# EAGLE design amp_tda8425_v_1_0 (EAGLE 9.3.1)
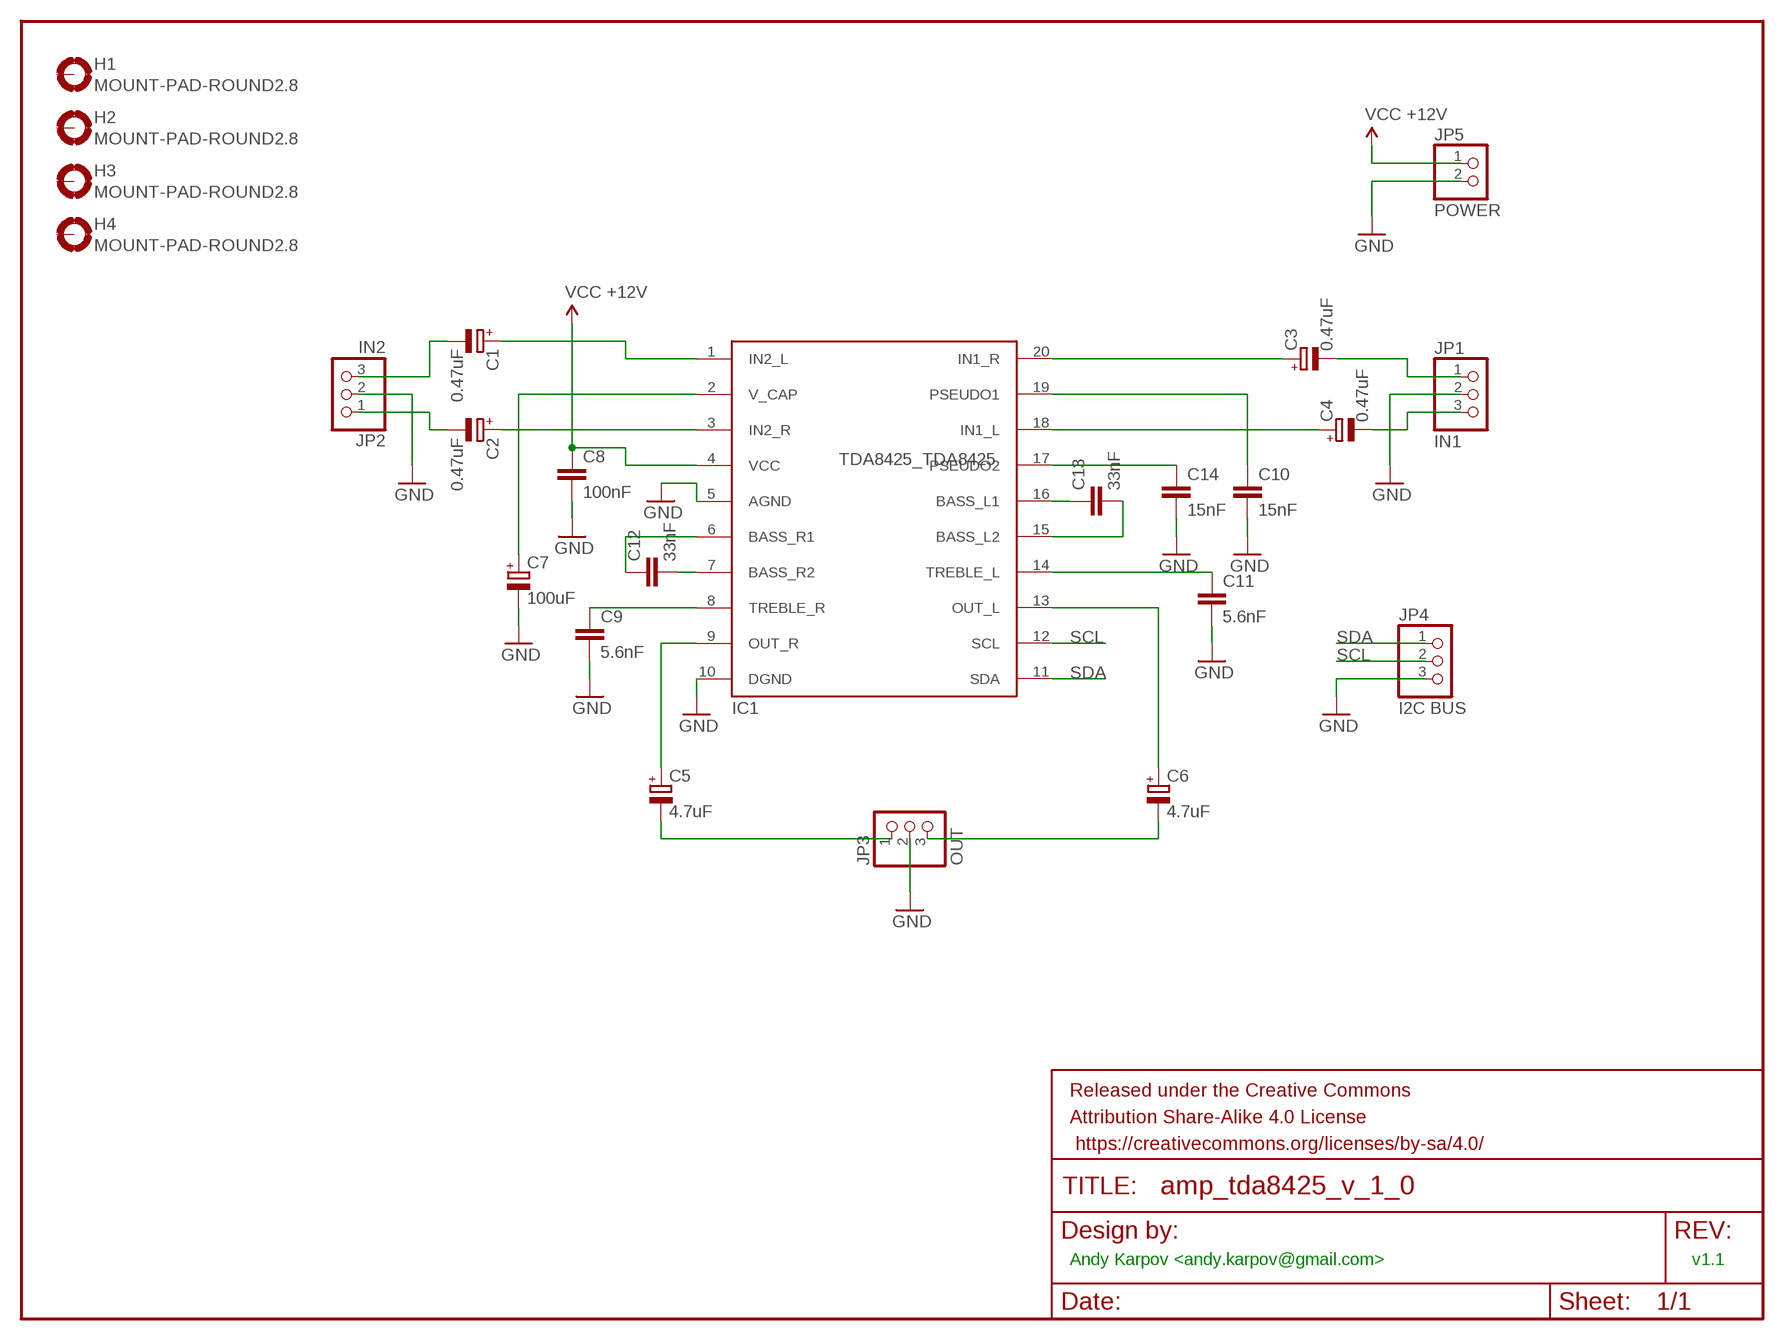
[diagram p0: schematic, sheet 1]

## Parts
C1  0.47uF  CPOL-EUE2.5-6  [E2,5-6]
C2  0.47uF  CPOL-EUE2.5-6  [E2,5-6]
C3  0.47uF  CPOL-EUE2.5-6  [E2,5-6]
C4  0.47uF  CPOL-EUE2.5-6  [E2,5-6]
C5  4.7uF  CPOL-EUE2.5-6  [E2,5-6]
C6  4.7uF  CPOL-EUE2.5-6  [E2,5-6]
C7  100uF  CPOL-EUE2.5-6  [E2,5-6]
C8  100nF  C-EU025-025X050  [C025-025X050]
C9  5.6nF  C-EU025-025X050  [C025-025X050]
C10  15nF  C-EU025-025X050  [C025-025X050]
C11  5.6nF  C-EU025-025X050  [C025-025X050]
C12  33nF  C-EU025-025X050  [C025-025X050]
C13  33nF  C-EU025-025X050  [C025-025X050]
C14  15nF  C-EU025-025X050  [C025-025X050]
FRAME1  FRAME-LETTER  [CREATIVE_COMMONS]
H1  MOUNT-PAD-ROUND2.8  [2,8-PAD]
H2  MOUNT-PAD-ROUND2.8  [2,8-PAD]
H3  MOUNT-PAD-ROUND2.8  [2,8-PAD]
H4  MOUNT-PAD-ROUND2.8  [2,8-PAD]
IC1  TDA8425_TDA8425  [TDA8425_DIL20]
JP1  IN1  PINHD-1X3  [1X03]
JP2  IN2  PINHD-1X3  [1X03]
JP3  OUT  PINHD-1X3  [1X03]
JP4  I2C BUS  PINHD-1X3  [1X03]
JP5  POWER  PINHD-1X2  [1X02]

## Nets
GND: C7.- C8.2 C9.2 C10.2 C11.2 C14.2 IC1.5(AGND) IC1.10(DGND) JP1.2 JP2.2 JP3.2 JP4.3 JP5.2
N$1: C1.+ IC1.1(IN2_L)
N$2: C1.- JP2.3
N$3: C2.+ IC1.3(IN2_R)
N$4: C2.- JP2.1
N$5: C3.+ IC1.20(IN1_R)
N$6: C4.+ IC1.18(IN1_L)
N$7: C3.- JP1.1
N$8: C4.- JP1.3
N$9: C7.+ IC1.2(V_CAP)
N$10: C12.1 IC1.6(BASS_R1)
N$11: C12.2 IC1.7(BASS_R2)
N$12: C9.1 IC1.8(TREBLE_R)
N$13: C5.+ IC1.9(OUT_R)
N$14: C5.- JP3.1
N$15: C6.+ IC1.13(OUT_L)
N$16: C6.- JP3.3
N$17: C13.1 IC1.16(BASS_L1)
N$18: C13.2 IC1.15(BASS_L2)
N$19: C14.1 IC1.17(PSEUDO2)
N$20: C11.1 IC1.14(TREBLE_L)
N$21: C10.1 IC1.19(PSEUDO1)
SCL: IC1.12(SCL) JP4.2
SDA: IC1.11(SDA) JP4.1
VCC: C8.1 IC1.4(VCC) JP5.1 ; supply symbol labelled VCC +12V
Unconnected: H1.B2,8(MOUNT) H2.B2,8(MOUNT) H3.B2,8(MOUNT) H4.B2,8(MOUNT)

## Notes on the sheet
- Andy Karpov <andy.karpov@gmail.com> | v1.1

## Library data of the parts
C1-C7 = rcl:CPOL-EU: POLARIZED CAPACITOR, European symbol; SPICEPREFIX: C
C8-C14 = rcl_mod:C-EU: CAPACITOR, European symbol
FRAME1 = SparkFun-Aesthetics:FRAME-LETTER: Schematic Frame - Letter Standard 8.5x11 US Letter frame
H1-H4 = holes:MOUNT-PAD-ROUND: MOUNTING PAD, round
IC1 = amp_tda8425_v_1_0:TDA8425_TDA8425: I2C bus controlled Audio HiFi Sound Processor
JP1-JP4 = pinhead:PINHD-1X3: PIN HEADER
JP5 = pinhead:PINHD-1X2: PIN HEADER

## Board
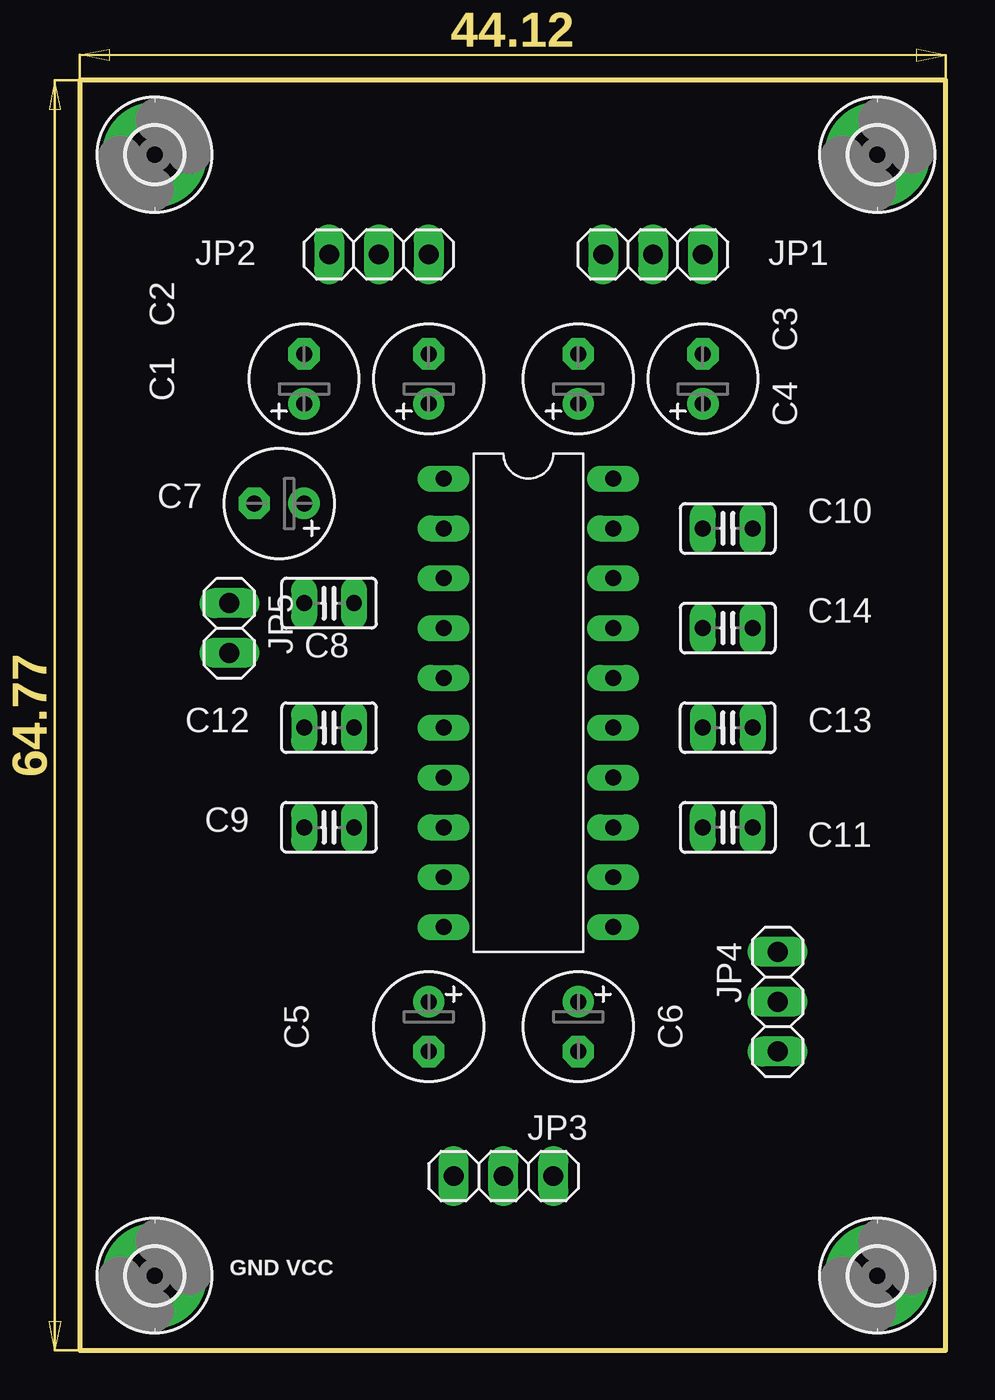
[diagram p1: board, top side]
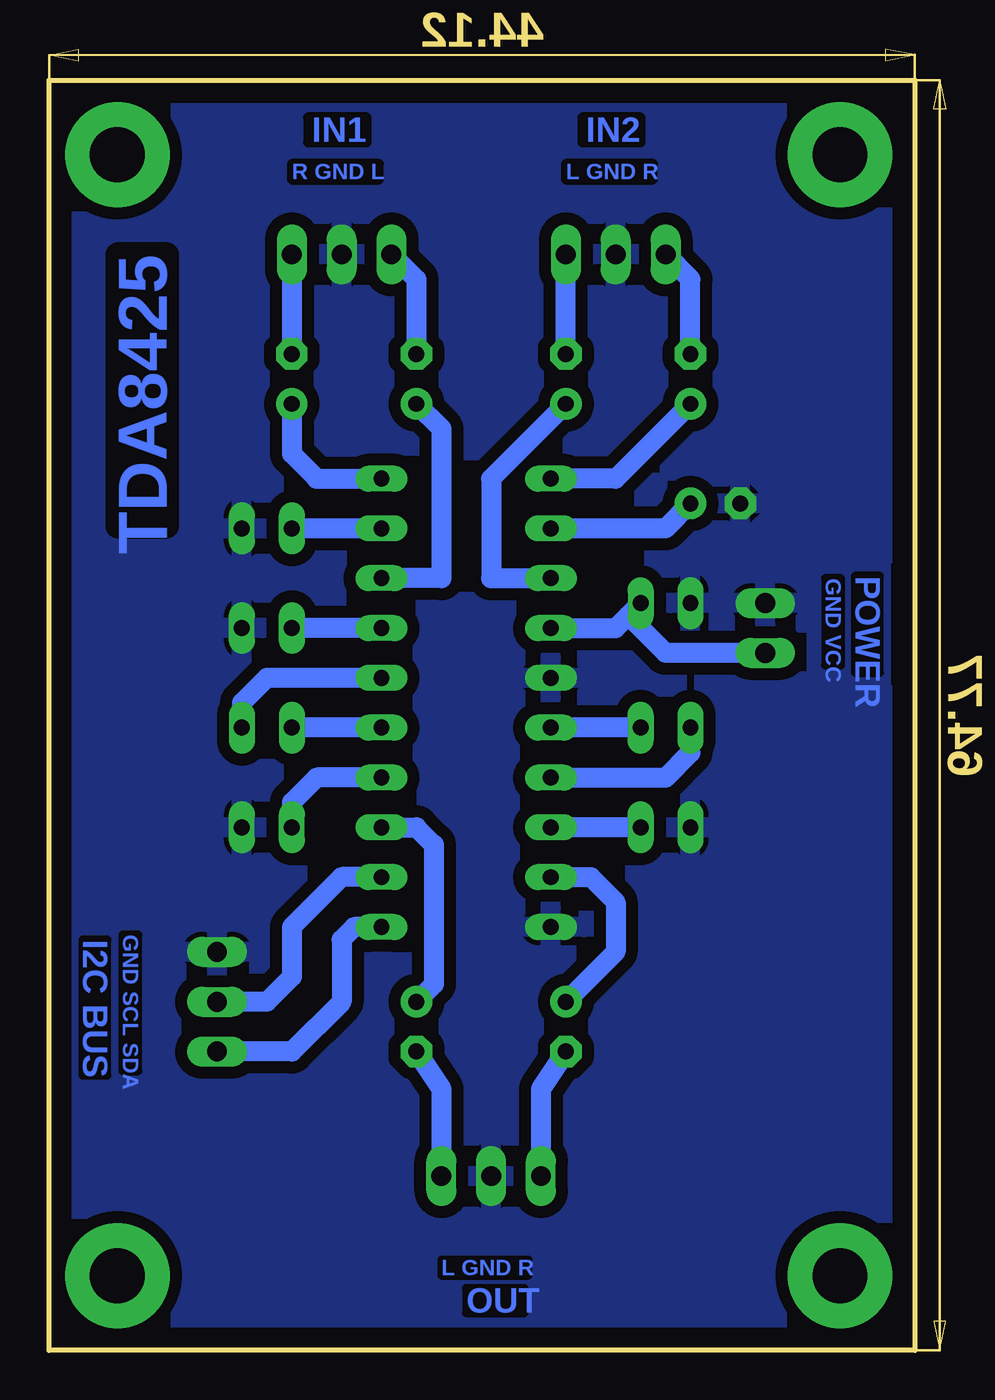
[diagram p2: board, bottom side, seen from below]

Size 44.12 x 64.76 mm. Coordinates in mm from the lower left corner, seen from the top.
Outline: 0,0 44.12,0 44.12,64.76 0,64.76 0,0
Copper layers (1*16): Top 0.035mm / dielectric 1.5mm / Bottom 0.035mm
Design rules "default": minimum track width 10mil, minimum drill 24mil, track to track 8mil, track to pad 8mil, pad to pad 8mil, via to via 8mil, smd to smd 8mil, copper to edge 40mil, drill to drill 8mil, minimum pad ring 10mil, minimum via ring 8mil, stop-mask expansion 4mil, vias tented up to drill 0mil, thermal gap 10mil

### Footprints (pad centres in the part's own frame; a part is rotated, then mirrored left to right if it is on the bottom)
E2,5-6 = drill 0.813 pad 1.6: + -1.27,0 | drill 0.813 pad 1.6 octagon: - 1.27,0
C025-025X050 = drill 0.813 long: 1 -1.27,0; 2 1.27,0
2,8-PAD = drill 2.8 pad 5.334: B2,8 0,0
TDA8425_DIL20 = drill 0.813 long: 1 -4.318,11.43; 2 -4.318,8.89; 3 -4.318,6.35; 4 -4.318,3.81; 5 -4.318,1.27; 6 -4.318,-1.27; 7 -4.318,-3.81; 8 -4.318,-6.35; 9 -4.318,-8.89; 10 -4.318,-11.43; 11 4.318,-11.43; 12 4.318,-8.89; 13 4.318,-6.35; 14 4.318,-3.81; 15 4.318,-1.27; 16 4.318,1.27; 17 4.318,3.81; 18 4.318,6.35; 19 4.318,8.89; 20 4.318,11.43
1X03 = drill 1.016 long: 1 -2.54,0; 2 0,0; 3 2.54,0
1X02 = drill 1.016 long: 1 -1.27,0; 2 1.27,0

### Placement (x,y rotation side)
C1  11.43,49.53 90 top
C2  17.78,49.53 90 top
C3  31.75,49.53 90 top
C4  25.4,49.53 90 top
C5  17.78,16.51 270 top
C6  25.4,16.51 270 top
C7  10.16,43.18 180 top
C8  12.7,38.1 180 top
C9  12.7,26.67 180 top
C10  33.02,41.91 0 top
C11  33.02,26.67 0 top
C12  12.7,31.75 180 top
C13  33.02,31.75 180 top
C14  33.02,36.83 0 top
FRAME1  0,69.85 0 top  (outside the outline)
H1  3.81,60.96 0 top
H2  40.64,60.96 0 top
H3  3.81,3.81 0 top
H4  40.64,3.81 0 top
IC1  22.86,33.02 0 top
JP1  29.21,55.88 180 top
JP2  15.24,55.88 180 top
JP3  21.59,8.89 0 top
JP4  35.56,17.78 90 top
JP5  7.62,36.83 90 top

### Tracks (layer width: path | path; a pad name or v marks a point on that pad's centre or on a via)
GND
  pour Bottom (isolate 0.61): 0,64.77 44.45,64.77 44.45,0 0,0
N$1
  Bottom 1.016: C1.+ 15.24,44.45 IC1.1
N$2
  Bottom 1.016: C1.- 11.43,54.61 JP2.3
N$3
  Bottom 1.016: C2.+ 21.59,44.45 21.59,39.37 IC1.3
N$4
  Bottom 1.016: C2.- JP2.1
N$5
  Bottom 1.016: C3.+ 31.75,45.72 30.48,44.45 IC1.20
N$6
  Bottom 1.016: C4.+ 24.13,46.99 24.13,39.37 IC1.18
N$7
  Bottom 1.016: JP1.1 C3.-
N$8
  Bottom 1.016: JP1.3 25.4,54.61 C4.-
N$9
  Bottom 1.016: C7.+ 12.7,41.91 IC1.2
N$10
  Bottom 1.016: C12.1 IC1.6
N$11
  Bottom 1.016: IC1.7 12.7,29.21 11.43,30.48 C12.2
N$12
  Bottom 1.016: C9.1 IC1.8
N$13
  Bottom 1.016: IC1.9 16.51,24.13 15.24,22.86 15.24,20.32 C5.+
N$14
  Bottom 1.016: C5.- 19.05,13.34 JP3.1
N$15
  Bottom 1.016: IC1.13 25.4,26.67 24.51,25.78 24.51,18.67 C6.+
N$16
  Bottom 1.016: C6.- 24.13,13.34 JP3.3
N$17
  Bottom 1.016: IC1.16 33.02,34.29 34.29,33.02 C13.1
N$18
  Bottom 1.016: IC1.15 C13.2
N$19
  Bottom 1.016: IC1.17 C14.1
N$20
  Bottom 1.016: IC1.14 30.48,29.21 31.75,27.94 C11.1
N$21
  Bottom 1.016: IC1.19 C10.1
N$22
  pour Bottom (isolate 0.254): 11.43,64.77 33.02,64.77 33.02,58.42 11.43,58.42
N$23
  pour Bottom: 1.27,40.64 5.46,40.64 5.46,31.75 1.27,31.75
N$24
  pour Bottom: 38.35,22.86 43.94,22.86 43.94,12.7 38.35,12.7
N$25
  pour Bottom: 16.51,6.35 26.67,6.35 26.67,0 16.51,0
SCL
  Bottom 1.016: IC1.12 29.21,24.13 31.75,21.59 31.75,19.05 33.02,17.78 JP4.2
SDA
  Bottom 1.016: IC1.11 28.57,21.59 29.21,20.95 29.21,17.78 31.75,15.24 JP4.1
VCC
  Bottom 1.016: IC1.4 15.24,36.83 14.61,37.47 | 14.61,37.47 C8.1 | JP5.1 12.7,35.56 14.61,37.47

### Text on the board
Bottom: L GND R | R GND L | TDA8425 | GND VCC | GND SCL SDA | L GND R
tNames: GND VCC